# EAGLE schematic thermometer (EAGLE 6.1)
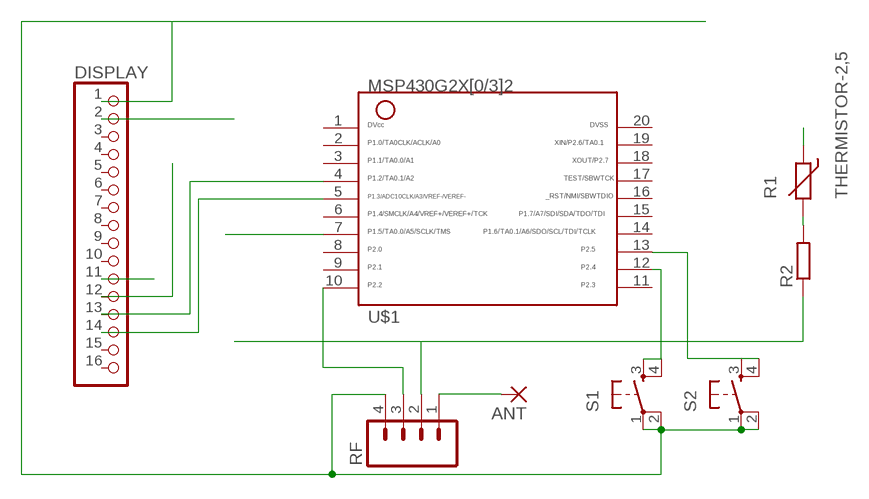
[diagram p0: schematic, sheet 1]

## Parts
ANT  2,54/0,9  [2,54/0,9]
DISPLAY  PINHD-1X16  [1X16]
R1  THERMISTOR-2,5  [RS-2,5]
R2  R-EU_0207/10  [0207/10]
RF  M04PTH  [1X04]
S1  TAC_SWITCHPTH  [TACTILE-PTH]
S2  TAC_SWITCHPTH  [TACTILE-PTH]
U$1  G2X[0/3]2---N20  [N20]

## Nets
GND: DISPLAY.1 RF.4 S1.1 S1.2 S2.1 S2.2
N$1: DISPLAY.14 U$1.5
N$2: DISPLAY.13 U$1.4
N$3: DISPLAY.12
N$4: R1.1
N$5: S2.3 S2.4 U$1.13
N$6: R2.1 RF.2
N$7: DISPLAY.11
N$8: U$1.7
N$10: R1.2 R2.2
N$13: S1.3 S1.4 U$1.12
N$14: RF.3 U$1.10
N$15: ANT.1(P) RF.1
N$16: DISPLAY.2
Unconnected: DISPLAY.3 DISPLAY.4 DISPLAY.5 DISPLAY.6 DISPLAY.7 DISPLAY.8 DISPLAY.9 DISPLAY.10 DISPLAY.15 DISPLAY.16 U$1.1 U$1.2 U$1.3 U$1.6 U$1.8 U$1.9 U$1.11 U$1.14 U$1.15 U$1.16 U$1.17 U$1.18 U$1.19 U$1.20

## Library data of the parts
ANT = wirepad:2,54/0,9: THROUGH-HOLE PAD
DISPLAY = pinhead:PINHD-1X16: PIN HEADER
R1 = varistor:THERMISTOR: THERMISTOR
R2 = resistor:R-EU_: RESISTOR, European symbol
RF = SparkFun-Connectors:M04: Header 4 Standard 4-pin 0.1" header. Use with straight break away headers (SKU : PRT-00116), right angle break away headers (PRT-00553), swiss pins (PRT-00743), machine pins (PRT-00117), and female headers (PRT-00115). Molex polarized connector foot print use with SKU : PRT-08231 with associated crimp pins and housings. 1MM SMD Version SKU: PRT-10208
S1 S2 = SparkFun-Electromechanical:TAC_SWITCH: Momentary Switch Button commonly used for reset or general input. Spark Fun Electronics SKU : COM-00097
U$1 = TI_MSP430_v16:G2X[0/3]2---N20: MSP430G2X[0/3]2 MSP430G2x32, MSP430G2x02 PDIP (N) 20 Pin Package http://focus.ti.com/docs/prod/folders/print/msp430g2432.html